# Altium schematic sheet M2_to_USB3.SchDoc
size A4; SheetNumber: 1; SheetTotal: 1
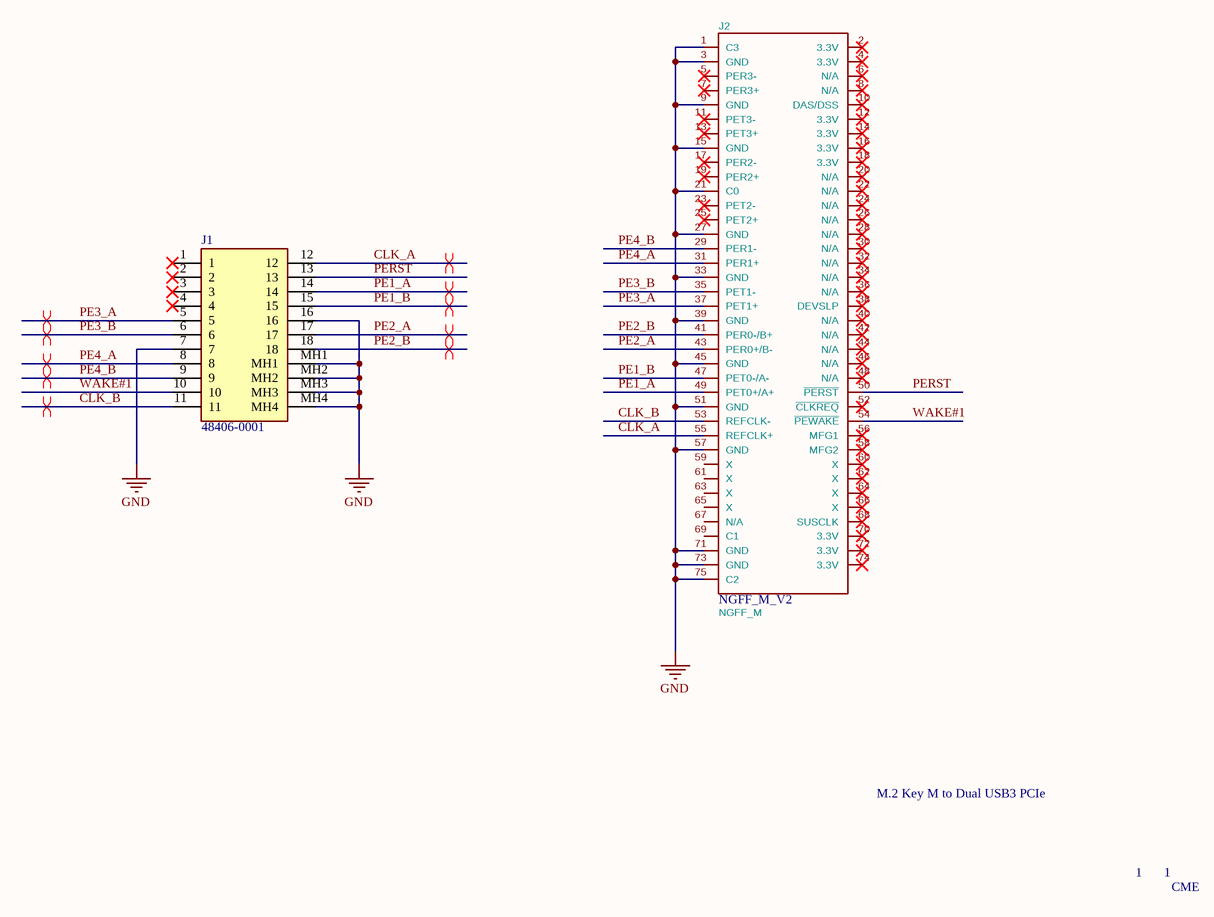
[diagram p0: M2_to_USB3.SchDoc]

## Parts
J1  48406-0001  [484060001]
J2  NGFF_M_V2  value NGFF_M  [M.2-M-KEY-2280-V2]

## Nets
GND: J1.7 J1.16 J1.MH1 J1.MH2 J1.MH3 J1.MH4 J2.1(C3) J2.3(GND) J2.9(GND) J2.15(GND) J2.21(C0) J2.27(GND) J2.33(GND) J2.39(GND) J2.45(GND) J2.51(GND) J2.57(GND) J2.71(GND) J2.73(GND) J2.75(C2)
CLK_A: J1.12 J2.55(REFCLK+)
CLK_B: J1.11 J2.53(REFCLK-)
PE1_A: J1.14 J2.49(PET0+/A+)
PE1_B: J1.15 J2.47(PET0-/A-)
PE2_A: J1.17 J2.43(PER0+/B-)
PE2_B: J1.18 J2.41(PER0-/B+)
PE3_A: J1.5 J2.37(PET1+)
PE3_B: J1.6 J2.35(PET1-)
PE4_A: J1.8 J2.31(PER1+)
PE4_B: J1.9 J2.29(PER1-)
PERST: J1.13 J2.50(~{PERST})
WAKE#1: J1.10 J2.54(~{PEWAKE})

Not connected (* = marked no-connect by the designer): J1 1* 2* 3* 4*; J2 2(3.3V)* 4(3.3V)* 5(PER3-)* 6(N/A)* 7(PER3+)* 8(N/A)* 10(DAS/DSS)* 11(PET3-)* 12(3.3V)* 13(PET3+)* 14(3.3V)* 16(3.3V)* 17(PER2-)* 18(3.3V)* 19(PER2+)* 20(N/A)* 22(N/A)* 23(PET2-)* 24(N/A)* 25(PET2+)* 26(N/A)* 28(N/A)* 30(N/A)* 32(N/A)* 34(N/A)* 36(N/A)* 38(DEVSLP)* 40(N/A)* 42(N/A)* 44(N/A)* 46(N/A)* 48(N/A)* 52(~{CLKREQ})* 56(MFG1)* 58(MFG2)* 59(X) 60(X)* 61(X) 62(X)* 63(X) 64(X)* 65(X) 66(X)* 67(N/A) 68(SUSCLK)* 69(C1) 70(3.3V)* 72(3.3V)* 74(3.3V)*

## Layout directives
differential pair: CLK_A, CLK_B, PE1_A, PE1_B, PE2_A, PE2_B, PE3_A, PE3_B, PE4_A, PE4_B

## Notes on the sheet
- M.2 Key M to Dual USB3 PCIe
- 1
- CME

## Library data of the parts
J1 = 48406-0001: Connector; Manufacturer_Name: Molex; Datasheet Link: https://www.molex.com/content/dam/molex/molex-dot-com/products/automated/en-us/salesdrawingpdf/484/48406/484060001_sd.pdf; Height: 15.65mm; Manufacturer_Part_Number: 48406-0001; Mouser Part Number: 538-48406-0001; Mouser Price/Stock: https://www.mouser.co.uk/ProductDetail/Molex/48406-0001?qs=tkvX2tz6JTEgpbDeTYwKTA%3D%3D